# EAGLE design board (EAGLE 9.2.2)
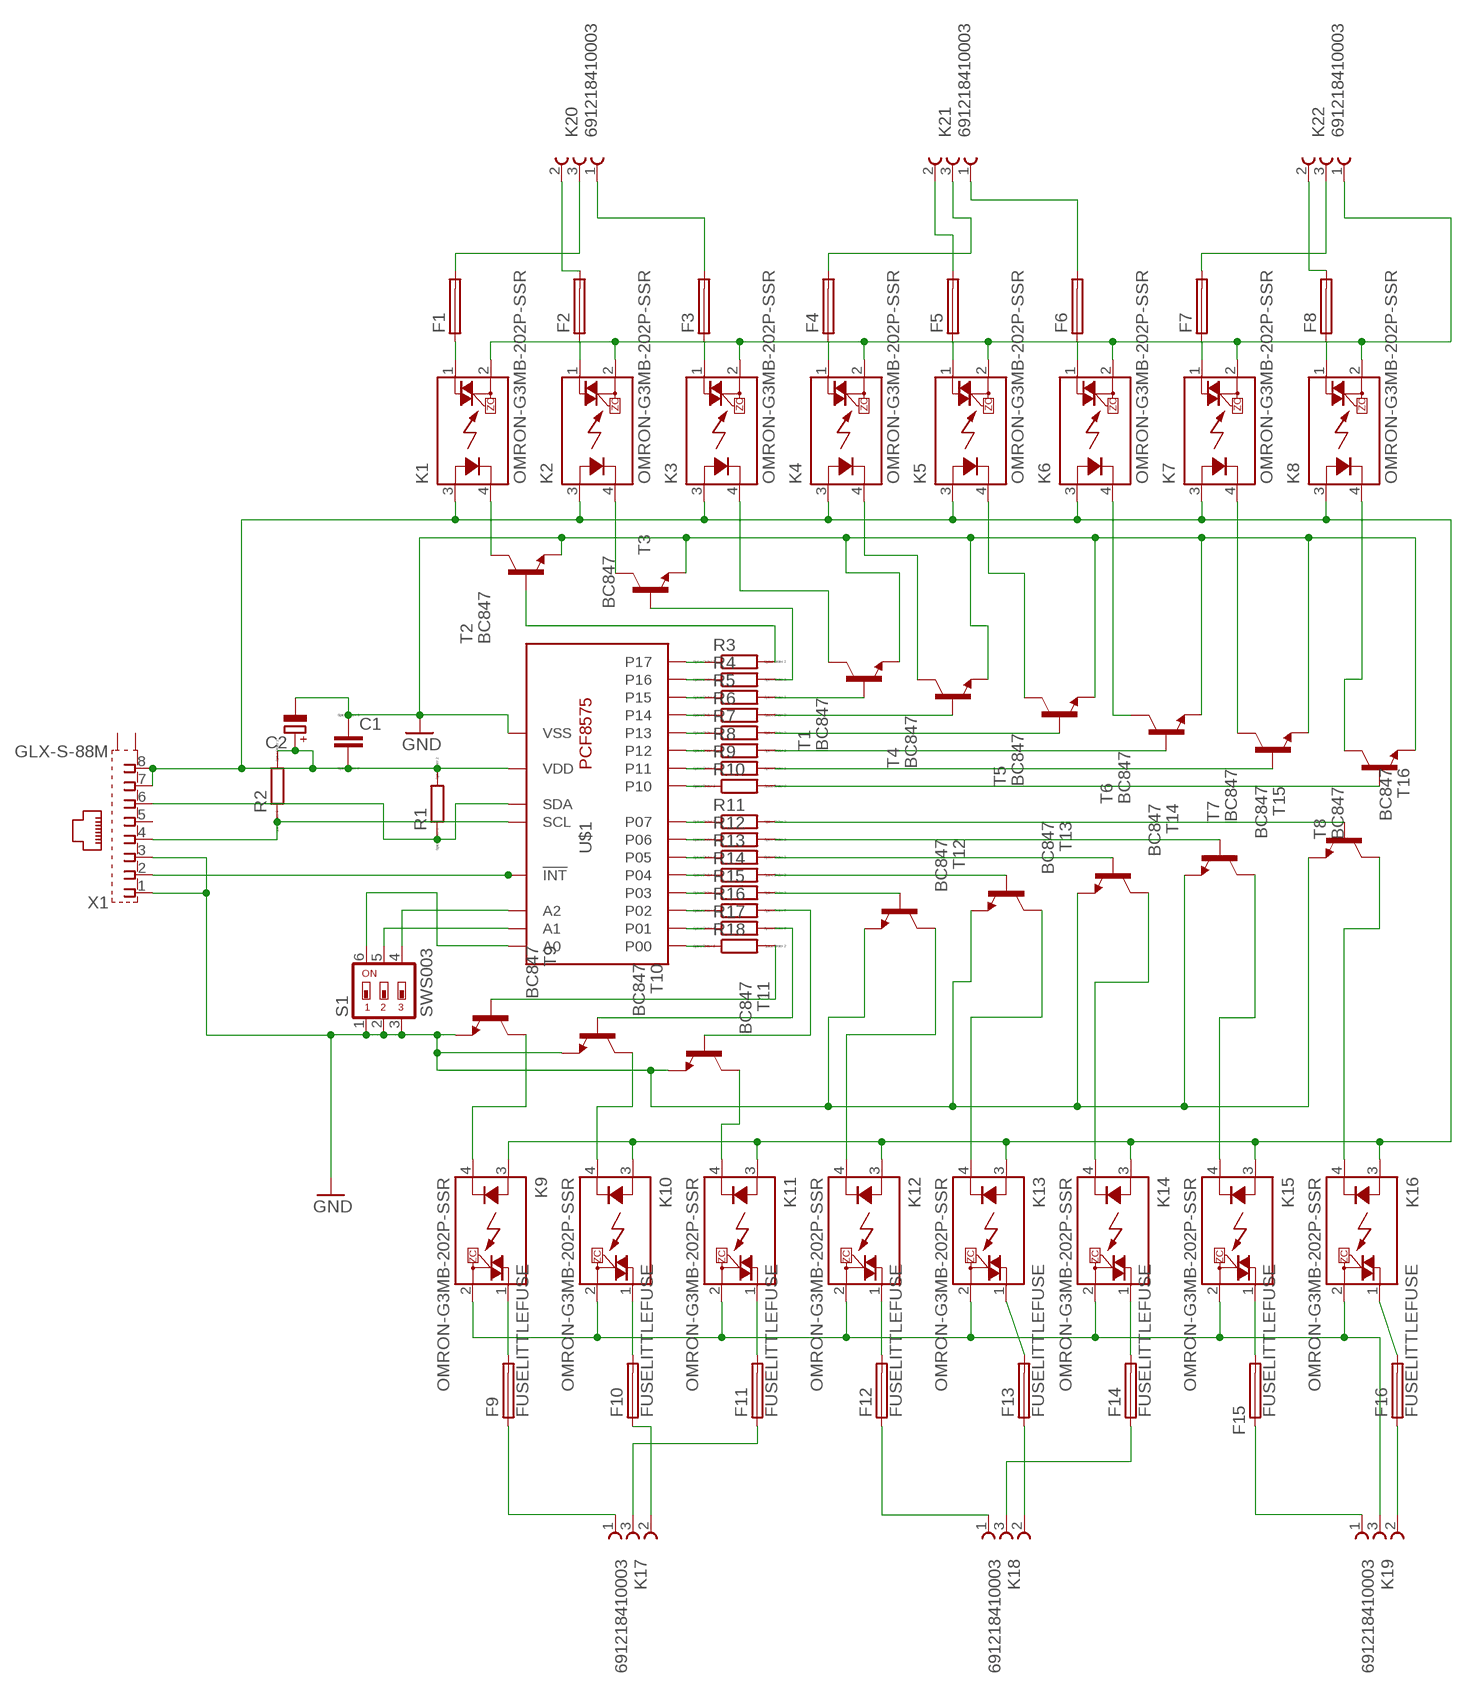
[diagram p0: schematic, sheet 1]

## Parts
C1  CC1206  [C1206]
C2  CPOL-EU150CLZ-0810  [150CLZ-0810]
F1  FUSELITTLEFUSE  [LITTLEFUSE]
F2  FUSELITTLEFUSE  [LITTLEFUSE]
F3  FUSELITTLEFUSE  [LITTLEFUSE]
F4  FUSELITTLEFUSE  [LITTLEFUSE]
F5  FUSELITTLEFUSE  [LITTLEFUSE]
F6  FUSELITTLEFUSE  [LITTLEFUSE]
F7  FUSELITTLEFUSE  [LITTLEFUSE]
F8  FUSELITTLEFUSE  [LITTLEFUSE]
F9  FUSELITTLEFUSE  [LITTLEFUSE]
F10  FUSELITTLEFUSE  [LITTLEFUSE]
F11  FUSELITTLEFUSE  [LITTLEFUSE]
F12  FUSELITTLEFUSE  [LITTLEFUSE]
F13  FUSELITTLEFUSE  [LITTLEFUSE]
F14  FUSELITTLEFUSE  [LITTLEFUSE]
F15  FUSELITTLEFUSE  [LITTLEFUSE]
F16  FUSELITTLEFUSE  [LITTLEFUSE]
K1  OMRON-G3MB-202P-SSR  [OMRON-G3MB-202P-SSR]
K2  OMRON-G3MB-202P-SSR  [OMRON-G3MB-202P-SSR]
K3  OMRON-G3MB-202P-SSR  [OMRON-G3MB-202P-SSR]
K4  OMRON-G3MB-202P-SSR  [OMRON-G3MB-202P-SSR]
K5  OMRON-G3MB-202P-SSR  [OMRON-G3MB-202P-SSR]
K6  OMRON-G3MB-202P-SSR  [OMRON-G3MB-202P-SSR]
K7  OMRON-G3MB-202P-SSR  [OMRON-G3MB-202P-SSR]
K8  OMRON-G3MB-202P-SSR  [OMRON-G3MB-202P-SSR]
K9  OMRON-G3MB-202P-SSR  [OMRON-G3MB-202P-SSR]
K10  OMRON-G3MB-202P-SSR  [OMRON-G3MB-202P-SSR]
K11  OMRON-G3MB-202P-SSR  [OMRON-G3MB-202P-SSR]
K12  OMRON-G3MB-202P-SSR  [OMRON-G3MB-202P-SSR]
K13  OMRON-G3MB-202P-SSR  [OMRON-G3MB-202P-SSR]
K14  OMRON-G3MB-202P-SSR  [OMRON-G3MB-202P-SSR]
K15  OMRON-G3MB-202P-SSR  [OMRON-G3MB-202P-SSR]
K16  OMRON-G3MB-202P-SSR  [OMRON-G3MB-202P-SSR]
K17  691218410003  [691218410003]
K18  691218410003  [691218410003]
K19  691218410003  [691218410003]
K20  691218410003  [691218410003]
K21  691218410003  [691218410003]
K22  691218410003  [691218410003]
R1  RR1206  [R1206]
R2  RR1206  [R1206]
R3  RR1206  [R1206]
R4  RR1206  [R1206]
R5  RR1206  [R1206]
R6  RR1206  [R1206]
R7  RR1206  [R1206]
R8  RR1206  [R1206]
R9  RR1206  [R1206]
R10  RR1206  [R1206]
R11  RR1206  [R1206]
R12  RR1206  [R1206]
R13  RR1206  [R1206]
R14  RR1206  [R1206]
R15  RR1206  [R1206]
R16  RR1206  [R1206]
R17  RR1206  [R1206]
R18  RR1206  [R1206]
S1  SWS003  [SMS-003]
T1  BC847  [SOT23]
T2  BC847  [SOT23]
T3  BC847  [SOT23]
T4  BC847  [SOT23]
T5  BC847  [SOT23]
T6  BC847  [SOT23]
T7  BC847  [SOT23]
T8  BC847  [SOT23]
T9  BC847  [SOT23]
T10  BC847  [SOT23]
T11  BC847  [SOT23]
T12  BC847  [SOT23]
T13  BC847  [SOT23]
T14  BC847  [SOT23]
T15  BC847  [SOT23]
T16  BC847  [SOT23]
U$1  PCF8575CSSOP24  [SOP65P775X200-24N]
X1  GLX-S-88M  [GLX-S-88M]

## Nets
GND: C1.1 C2.- S1.1 S1.2 S1.3 T1.2(E) T2.2(E) T3.2(E) T4.2(E) T5.2(E) T6.2(E) T7.2(E) T8.2(E) T9.2(E) T10.2(E) T11.2(E) T12.2(E) T13.2(E) T14.2(E) T15.2(E) T16.2(E) U$1.12(VSS) X1.1 X1.3
N$1: F16.2 K16.1(DS1)
N$2: U$1.1(!INT) X1.2
N$3: R3.1 U$1.20(P17)
N$4: R4.1 U$1.19(P16)
N$5: R18.2 T9.1(B)
N$6: R5.1 U$1.18(P15)
N$7: R6.1 U$1.17(P14)
N$8: R7.1 U$1.16(P13)
N$9: R8.1 U$1.15(P12)
N$10: R9.1 U$1.14(P11)
N$11: R10.1 U$1.13(P10)
N$12: R11.1 U$1.11(P07)
N$13: R12.1 U$1.10(P06)
N$14: R13.1 U$1.9(P05)
N$15: R14.1 U$1.8(P04)
N$16: R15.1 U$1.7(P03)
N$17: R16.1 U$1.6(P02)
N$18: R17.1 U$1.5(P01)
N$19: R2.1 U$1.22(SCL) X1.4
N$20: S1.4 U$1.3(A2)
N$21: R1.1 U$1.23(SDA) X1.6
N$22: K9.2(DS2) K10.2(DS2) K11.2(DS2) K12.2(DS2) K13.2(DS2) K14.2(DS2) K15.2(DS2) K16.2(DS2) K19.3
N$23: F13.2 K13.1(DS1)
N$24: F14.1 K18.3
N$25: F10.1 K17.2
N$26: F11.1 K17.3
N$27: S1.6 U$1.21(A0)
N$28: S1.5 U$1.2(A1)
N$29: C1.2 C2.+ K1.3(A) K2.3(A) K3.3(A) K4.3(A) K5.3(A) K6.3(A) K7.3(A) K8.3(A) K9.3(A) K10.3(A) K11.3(A) K12.3(A) K13.3(A) K14.3(A) K15.3(A) K16.3(A) R1.2 R2.2 U$1.24(VDD) X1.7 X1.8
N$30: F9.1 K17.1
N$31: F1.1 K1.1(DS1)
N$32: F2.1 K2.1(DS1)
N$33: F12.1 K18.1
N$34: F3.1 K3.1(DS1)
N$35: F4.1 K4.1(DS1)
N$36: F15.1 K19.1
N$37: F5.1 K5.1(DS1)
N$38: K1.2(DS2) K2.2(DS2) K3.2(DS2) K4.2(DS2) K5.2(DS2) K6.2(DS2) K7.2(DS2) K8.2(DS2) K22.1
N$39: F8.2 K22.2
N$40: F7.2 K22.3
N$41: F6.2 K21.1
N$42: F5.2 K21.2
N$43: F4.2 K21.3
N$44: F3.2 K20.1
N$45: F6.1 K6.1(DS1)
N$46: F1.2 K20.3
N$47: F7.1 K7.1(DS1)
N$48: F8.1 K8.1(DS1)
N$49: F9.2 K9.1(DS1)
N$50: F2.2 K20.2
N$51: F10.2 K10.1(DS1)
N$52: F11.2 K11.1(DS1)
N$53: F12.2 K12.1(DS1)
N$54: F14.2 K14.1(DS1)
N$55: F15.2 K15.1(DS1)
N$56: F16.1 K19.2
N$57: F13.1 K18.2
N$58: R18.1 U$1.4(P00)
N$59: R3.2 T2.1(B)
N$60: K1.4(K) T2.3(C)
N$61: R4.2 T3.1(B)
N$62: K2.4(K) T3.3(C)
N$63: R5.2 T1.1(B)
N$64: R6.2 T4.1(B)
N$65: R7.2 T5.1(B)
N$66: R8.2 T6.1(B)
N$67: R9.2 T7.1(B)
N$68: R10.2 T8.1(B)
N$69: K8.4(K) T8.3(C)
N$70: K7.4(K) T7.3(C)
N$71: K6.4(K) T6.3(C)
N$72: K5.4(K) T5.3(C)
N$73: R17.2 T10.1(B)
N$74: K4.4(K) T4.3(C)
N$76: K3.4(K) T1.3(C)
N$78: K9.4(K) T9.3(C)
N$79: K10.4(K) T10.3(C)
N$80: K11.4(K) T11.3(C)
N$81: R16.2 T11.1(B)
N$82: R11.2 T16.1(B)
N$83: R12.2 T15.1(B)
N$84: R13.2 T14.1(B)
N$85: R14.2 T13.1(B)
N$86: R15.2 T12.1(B)
N$87: K16.4(K) T16.3(C)
N$88: K15.4(K) T15.3(C)
N$89: K14.4(K) T14.3(C)
N$90: K13.4(K) T13.3(C)
N$92: K12.4(K) T12.3(C)
Unconnected: X1.5 X1.S1 X1.S2

## Library data of the parts
C1 = eagle-ltspice:C: CAPACITOR, European symbol; SPICEMODEL: NONE; SPICEPREFIX: C
C2 = rcl:CPOL-EU: POLARIZED CAPACITOR, European symbol; SPICEPREFIX: C
F1-F16 = fuse:FUSE: Fuse; OC_FARNELL: unknown; OC_NEWARK: unknown
K1-K16 = Omron G3MB 202p SSR:OMRON-G3MB-202P-SSR: IT(rms) 8A, Zero Cross type SIP 4pin Triac output SSR Source: http://sharp-world.com/products/device/lineup/data/pdf/datasheet/s102s02_e.pdf
K17-K22 = Wurth_Elektronik_Electromechanic_Terminal_Blocks_Connectors_rev15c:691218410003: WR-TBL Serie 2184 - 7.62mm Horizontal Entry Modular with Rising Cage Clamp - 5.3mm2 Wires, 3 Pins=>Code : Con_TBL_Screw_RisingClamp_7.62_691218410003 <http://katalog.we-online.de/media/images/eican/Con_TBL_Screw_RisingClamp_7.62_6912184100xx_pf2.jpg> Details see: http://katalog.we-online.de/en/em/691_218_410_0xx Created 2014-06-18, Karrer Zheng 2014 (C) Würth Elektronik
R1-R18 = eagle-ltspice:R: RESISTOR, European symbol; SPICEMODEL: NONE; SPICEPREFIX: R
S1 = smd-special:SWS003: SMD Dip Switch 3 pol.
T1-T16 = transistor:BC847: NPN TRANSISTOR
U$1 = pcf8575c:PCF8575C
X1 = con-kycon:GLX-S-88M: Mod. Jack, Right Angle, 8 posiotion, 8 contatcs RJ45 Source: GLX-S-88M.pdf; OC_FARNELL: unknown; OC_NEWARK: unknown

## Board
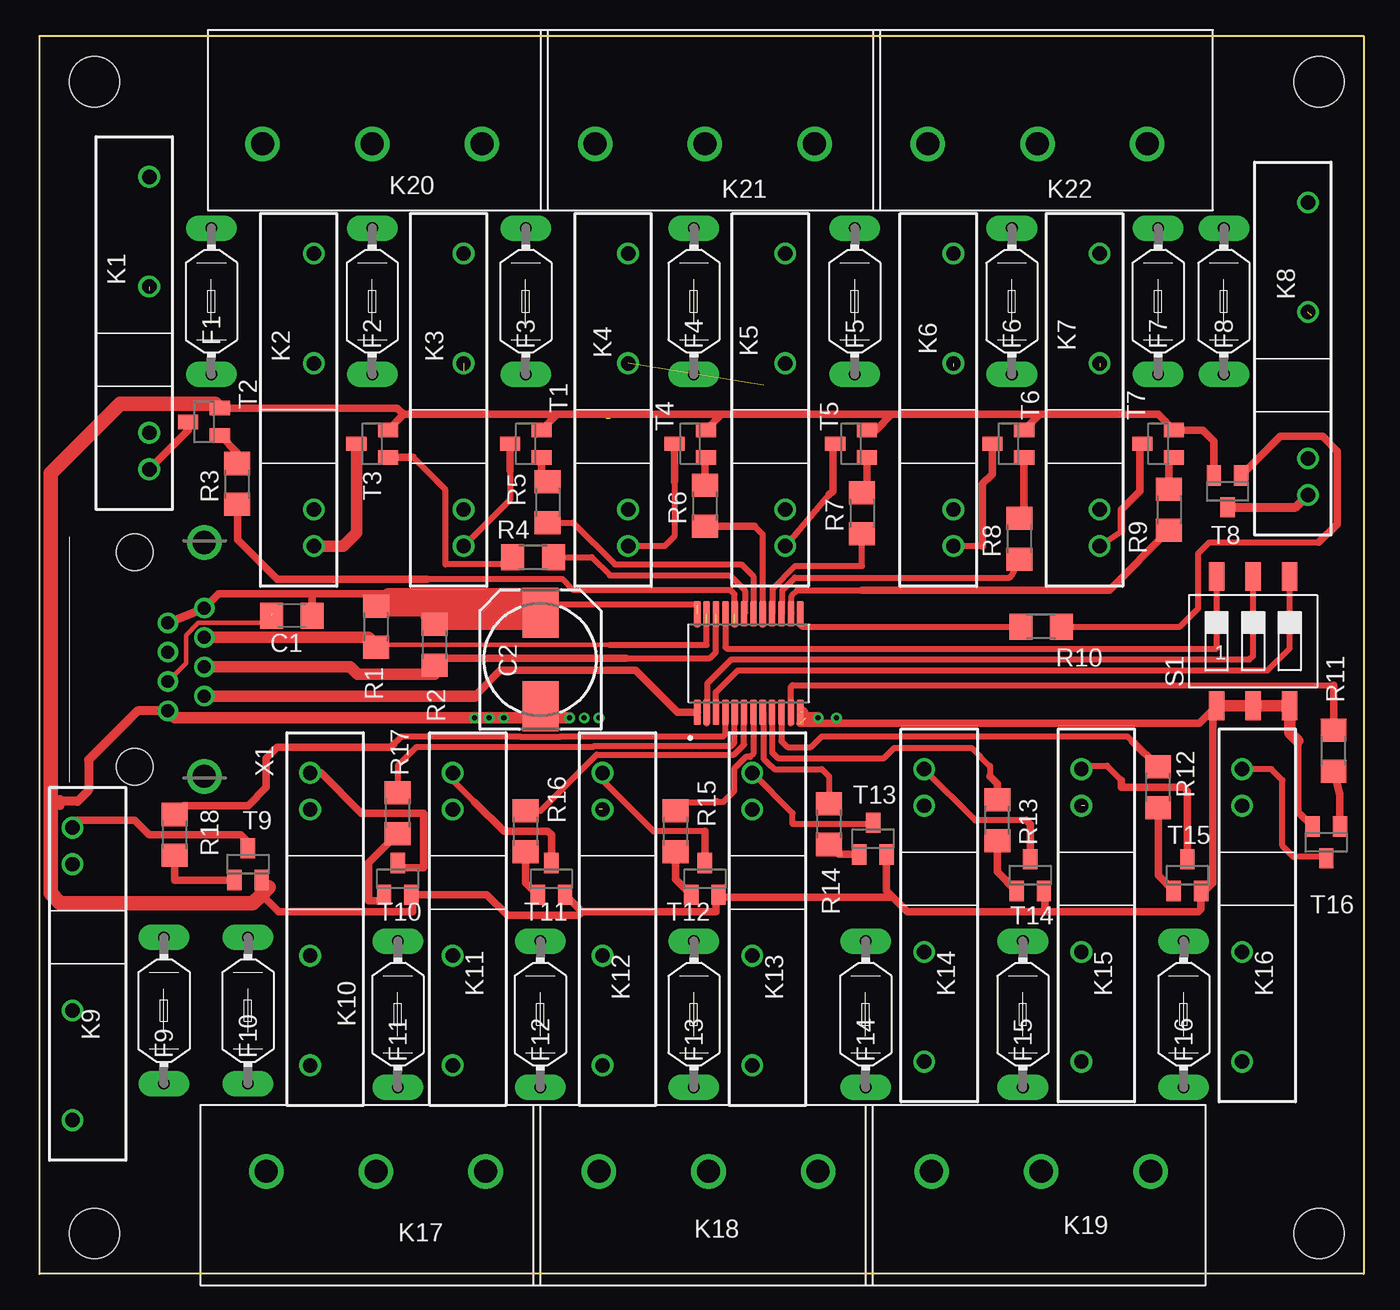
[diagram p1: board, top side]
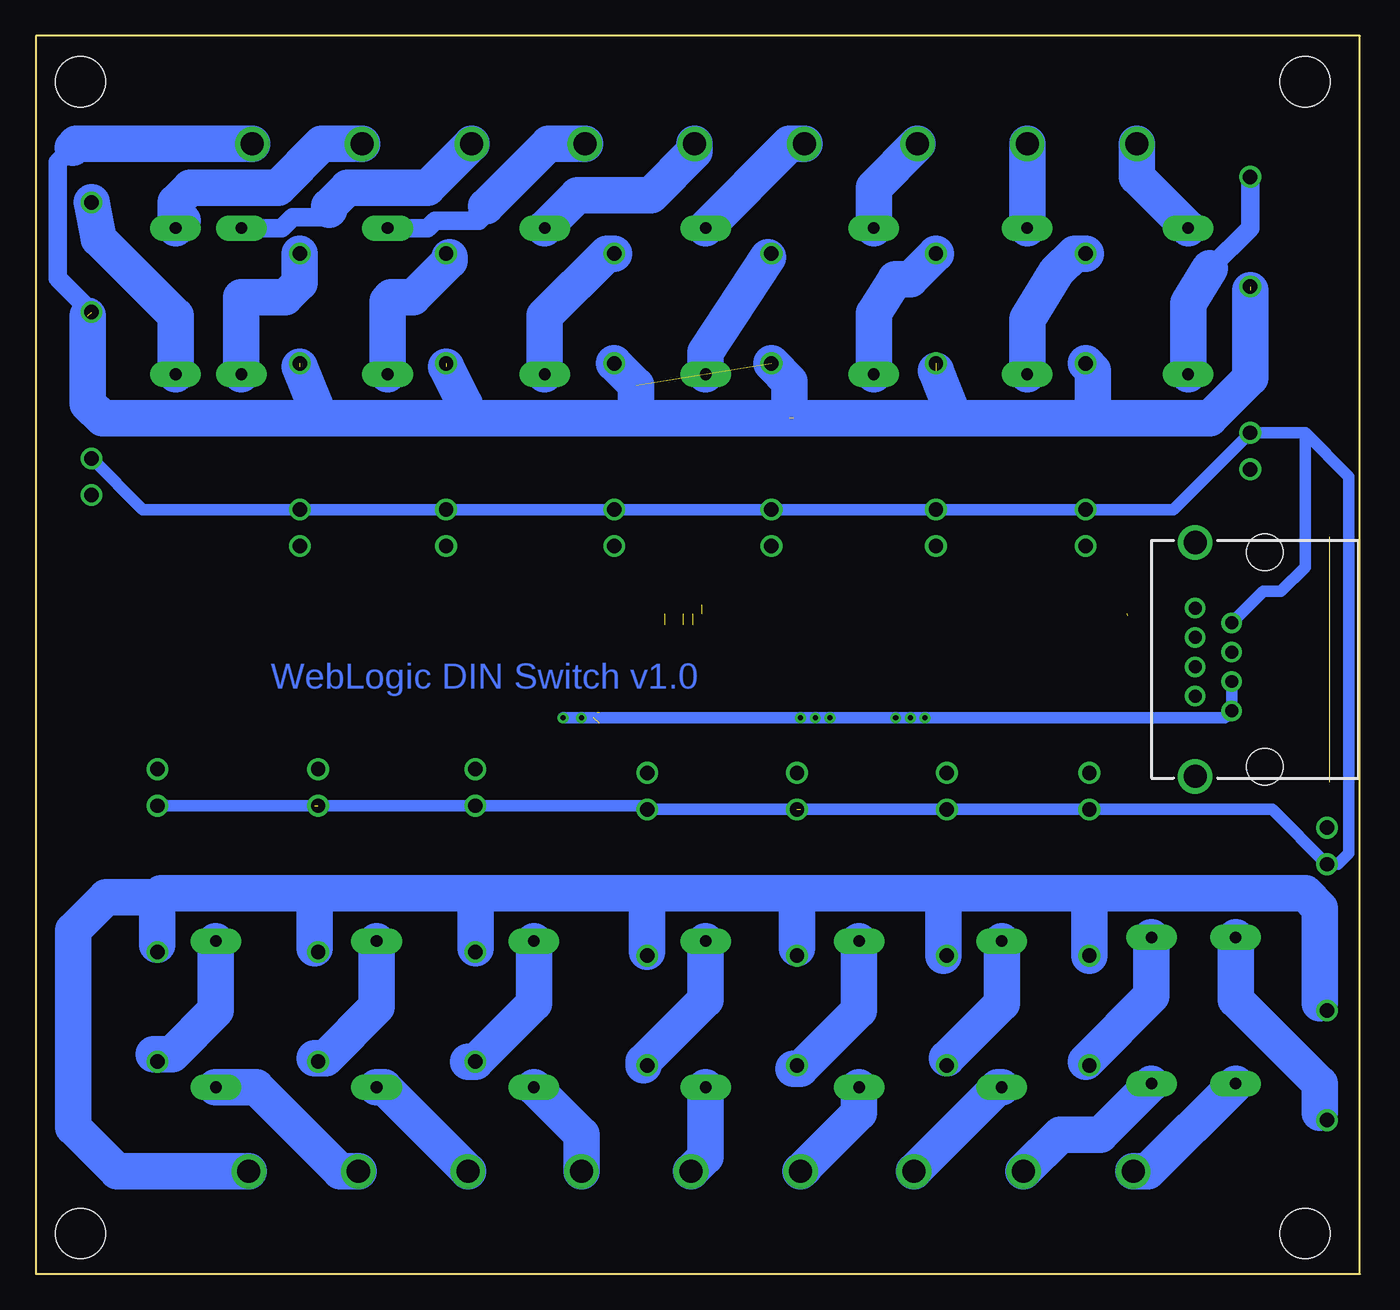
[diagram p2: board, bottom side, seen from below]

Size 92 x 86 mm. Coordinates in mm from the lower left corner, seen from the top.
Outline: 0,0 0,86 92,86 92,0 0,0
Copper layers (1*16): Top 0.035mm / dielectric 1.5mm / Bottom 0.035mm
Design rules "default": minimum track width 6mil, minimum drill 0.35mm, track to track 6mil, track to pad 6mil, pad to pad 6mil, via to via 6mil, smd to smd 6mil, copper to edge 40mil, drill to drill 6mil, minimum pad ring 10mil, minimum via ring 8mil, stop-mask expansion 4mil, vias tented up to drill 0mil, thermal gap 10mil
Holes 3.48 mm at 3.81,82.82 88.9,82.82 88.9,2.81 3.81,2.81

### Footprints (pad centres in the part's own frame; a part is rotated, then mirrored left to right if it is on the bottom)
C1206 = smd 1.6 x 1.8: 1 -1.4,0; 2 1.4,0
150CLZ-0810 = smd 3.5 x 2.5: + 3.25,0; - -3.25,0
LITTLEFUSE = drill 0.813 pad 1.778 long: 1 -5.08,0; 2 5.08,0
OMRON-G3MB-202P-SSR = drill 1: 1 -12.7,0; 2 -5.08,0; 3 5.08,0; 4 7.62,0
691218410003 = drill 1.6: 1 -7.62,0; 2 0,0; 3 7.62,0
R1206 = smd 1.6 x 1.803: 1 -1.422,0; 2 1.422,0
SMS-003 = smd 1.092 x 2.007: 1 -2.54,-4.496; 2 0,-4.496; 3 2.54,-4.496; 4 2.54,4.496; 5 0,4.496; 6 -2.54,4.496
SOT23 = smd 1 x 1.4: 1 -0.95,-1.1; 2 0.95,-1.1; 3 0,1.1
SOP65P775X200-24N = smd 1.78 x 0.48: 1 -3.42,3.575; 2 -3.42,2.925; 3 -3.42,2.275; 4 -3.42,1.625; 5 -3.42,0.975; 6 -3.42,0.325; 7 -3.42,-0.325; 8 -3.42,-0.975; 9 -3.42,-1.625; 10 -3.42,-2.275; 11 -3.42,-2.925; 12 -3.42,-3.575; 13 3.42,-3.575; 14 3.42,-2.925; 15 3.42,-2.275; 16 3.42,-1.625; 17 3.42,-0.975; 18 3.42,-0.325; 19 3.42,0.325; 20 3.42,0.975; 21 3.42,1.625; 22 3.42,2.275; 23 3.42,2.925; 24 3.42,3.575
GLX-S-88M = drill 0.9 pad 1.422: 1 -3.57,-2.3; 2 -2.55,-4.84; 3 -1.53,-2.3; 4 -0.51,-4.84; 5 0.51,-2.3; 6 1.53,-4.84; 7 2.55,-2.3; 8 3.57,-4.84 | drill 1.6 pad 2.184: S1 -8.125,-4.84; S2 8.125,-4.84 | hole 2.55: -7.44,0; 7.44,0

### Placement (x,y rotation side)
C1  17.53,45.74 0 top
C2  34.8,42.69 90 top
F1  11.94,67.58 90 top
F2  23.11,67.58 90 top
F3  33.78,67.58 90 top
F4  45.47,67.58 90 top
F5  56.64,67.58 90 top
F6  67.56,67.58 90 top
F7  77.72,67.58 90 top
F8  82.3,67.58 90 top
F9  8.64,18.3 90 top
F10  14.48,18.3 90 top
F11  24.89,18.05 90 top
F12  34.8,18.05 90 top
F13  45.47,18.05 90 top
F14  57.4,18.05 90 top
F15  68.33,18.05 90 top
F16  79.5,18.05 90 top
K1  7.62,63.52 270 top
K2  19.05,58.18 270 top
K3  29.46,58.18 270 top
K4  40.89,58.18 270 top
K5  51.82,58.18 270 top
K6  63.5,58.18 270 top
K7  73.66,58.18 270 top
K8  88.14,61.74 270 top
K9  2.29,23.38 90 top
K10  18.8,27.19 90 top
K11  28.7,27.19 90 top
K12  39.12,27.19 90 top
K13  49.53,27.19 90 top
K14  61.47,27.45 90 top
K15  72.39,27.45 90 top
K16  83.57,27.45 90 top
K17  23.37,7.13 0 top
K18  46.48,7.13 0 top
K19  69.6,7.13 0 top
K20  23.11,78.5 180 top
K21  46.23,78.5 180 top
K22  69.34,78.5 180 top
R1  23.37,44.97 90 top
R2  27.43,43.7 90 top
R3  13.72,54.88 90 top
R4  34.29,49.8 180 top
R5  35.31,53.61 90 top
R6  46.23,53.36 90 top
R7  57.15,52.85 90 top
R8  68.07,51.07 90 top
R9  78.49,53.1 90 top
R10  69.6,44.97 0 top
R11  89.92,36.34 270 top
R12  77.72,33.8 270 top
R13  66.55,31.51 270 top
R14  54.86,31.26 270 top
R15  44.2,30.75 270 top
R16  33.78,30.75 270 top
R17  24.89,32.02 270 top
R18  9.4,30.5 270 top
S1  84.33,43.96 0 top
T1  33.78,57.67 90 top
T2  11.43,59.2 90 top
T3  23.11,57.67 90 top
T4  45.21,57.67 90 top
T5  56.39,57.67 90 top
T6  67.31,57.67 90 top
T7  77.72,57.67 90 top
T8  82.55,54.37 180 top
T9  14.48,28.46 0 top
T10  24.89,27.45 0 top
T11  35.56,27.45 0 top
T12  46.23,27.45 0 top
T13  57.91,30.24 0 top
T14  68.83,27.7 0 top
T15  79.76,27.7 0 top
T16  89.41,29.99 180 top
U$1  49.28,42.43 90 top
X1  6.6,42.69 90 top

### Tracks (layer width: path | path; a pad name or v marks a point on that pad's centre or on a via)
GND  (via drill 0.35)  (3 unrouted)
  Top 0.305: S1.2 S1.3 | X1.3 10.17,42.43 10.17,44.38 11.02,45.23 15.52,45.23 16.15,45.86
  Top 0.508: 87.44,37.03 87.44,32.1 T16.2 | 81.46,39.13 S1.1 | S1.1 80.58,38.25 52.85,38.25 | T13.2 58.86,26.62 59.3,26.18 | 59.3,26.18 60.32,25.16 69.85,25.16 | 59.3,26.18 47.35,26.18 T12.2 46.99,26.16 46.99,25.16 37.7,25.16 | T11.2 37.7,25.16 | 37.7,25.16 37.44,24.91 32.51,24.91 31.07,26.35 T10.2 25.91,26.28 25.91,25.16 16.61,25.16 15.42,26.36 | T9.2 15.93,26.86 | T8.2 81.6,57.86 80.84,58.62 T7.2 77.74,59.71 69.49,59.71 | T6.2 69.49,59.71 | T5.2 58.1,58.62 59.18,59.71 | 59.18,59.71 69.49,59.71 | T4.2 47.39,59.71 | 47.39,59.71 59.18,59.71 | 35.96,59.71 47.39,59.71 | T1.2 35.96,59.71 | T3.2 25.3,59.71 | 25.3,59.71 35.96,59.71 | T2.2 24.85,60.15 25.3,59.71 | T14.2 69.85,26.54 69.85,25.16 | 69.85,25.16 80.52,25.16 80.71,25.35 T15.2 80.94,26.6 81.53,27.19 81.53,39.21 S1.1
  Top 0.61: X1.1 6.8,39.12 3.4,35.72 3.4,33.61 2.63,32.84 1.54,32.84 1.4,32.98 1.4,32.53
  Top 0.813: S1.1 S1.3 86.87,37.61 87.44,37.03 | X1.1 9.4,38.62 v30.23,38.62 v31.24,38.62 v32.26,38.62 34.8,38.62 | 34.8,38.62 C2.- | v54.1,38.62 53.24,38.62 53,38.87 53,39.01 | v36.83,38.62 34.8,38.62
  Top 1.016: T2.2 12.21,60.47 5.59,60.47 0.76,55.64 0.76,26.43 1.44,25.75 14.81,25.75 15.42,26.36 15.93,26.86
  Bottom 0.813: X1.3 X1.1 9.4,38.62 v30.23,38.62 v31.24,38.62 v32.26,38.62 v36.83,38.62 v37.85,38.62 v38.86,38.62 v54.1,38.62 v55.37,38.62
N$1
  Bottom 2.54: F16.2 79.5,18.3 82.55,15.26 83.82,15.26
N$2
  Top 0.508: 30.22,40.14 32,41.93 41.4,41.93 44.31,39.01 U$1.1
  Top 0.813: X1.2 30.22,40.14 30.23,40.15
N$3  (1 unrouted)
  Top 0.305: 14.12,53.06 13.77,53.41 R3.1
  Top 0.406: 48.3,45.09 48.3,47.22 48.01,47.51 37.08,47.51 36.32,48.28 26.92,48.28
  Top 0.508: 26.92,48.28 16.51,48.28 13.77,51.02 13.77,53.41
N$4
  Top 0.406: 36.14,50.23 R4.1 38.35,49.8 39.62,48.53 47.98,48.53 49.01,47.5 49.01,45.91 U$1.19
  Top 0.508: R4.1 36.22,49.8
N$5
  Top 0.508: T9.1 9.4,27.36 R18.2
N$6
  Top 0.406: R5.1 37.08,52.19 39.98,49.29 48.77,49.29 49.6,48.46 U$1.18
  Top 0.508: R5.1 35.41,52.09
N$7
  Top 0.406: 50.25,45.09 50.25,51.37 49.68,51.93
  Top 0.508: 49.68,51.93 R6.1
N$8
  Top 0.406: U$1.16 50.95,45.91 50.95,47.65 52.5,49.19 57.15,49.19 R7.1
N$9
  Top 0.406: U$1.15 51.6,45.91 51.6,47.5 52.48,48.38 67.41,48.38 67.56,48.53 R8.1
  Top 0.508: 67.72,49.29 R8.1
N$10
  Top 0.406: U$1.14 52.26,45.91 52.26,47.11 52.66,47.51 57.15,47.51
  Top 0.508: R9.1 74.32,47.51 57.15,47.51
N$11
  Top 0.406: 52.85,45.09 52.97,44.97 R10.1
N$12
  Top 0.406: 52.2,38.25 52.2,40.79 52.32,40.91 89.92,40.91
  Top 0.508: 89.92,40.91 R11.1
N$13
  Top 0.406: 51.55,38.25 51.55,37.02 51.98,36.59 53.59,36.59 54.36,37.35 75.59,37.35 75.92,37.02
  Top 0.508: 77.72,34.81 R12.1 75.92,37.02
N$14
  Top 0.406: 50.9,38.25 50.9,36.24 51.31,35.83 58.67,35.83 59.38,36.54 64.77,36.54 66.04,35.27 66.04,34.56
  Top 0.508: 66.28,33.2 R13.1 66.55,34.05 66.04,34.56
N$15
  Top 0.406: U$1.8 50.3,38.96 50.3,35.79 50.82,35.27 50.85,35.27 51.05,35.07 54.36,35.07 54.86,34.56 R14.1
N$16
  Top 0.406: R15.1 44.81,32.78 46.99,32.78 | 46.99,32.78 47.06,32.85 | U$1.7 49.6,36.16 49.37,35.92 49.07,35.92 48.26,35.11 48.26,33.54 47.5,32.78 46.99,32.78
  Top 0.508: R15.1 44.35,32.02
N$17
  Top 0.406: R16.1 34.8,32.17 38.71,36.08 48.26,36.08 48.95,36.77 U$1.6
N$18
  Top 0.406: U$1.5 48.26,38.97 48.26,36.87 48.03,36.64 38.48,36.64 38.43,36.59 26.16,36.59 24.89,35.32 R17.1
  Top 0.508: 24.89,33.8 R17.1
N$19  (1 unrouted)
  Top 0.406: 40.74,42.79 46.58,42.79 47,43.21 47,45.09
  Top 0.508: 40.74,42.79 27.94,42.79 R2.1
  Top 0.813: X1.4 21.59,42.18 22.1,41.67 27.43,41.67 R2.1
N$20
  Top 0.406: U$1.3 47,40.41 48.51,41.93 85.34,41.93 86.87,43.45 S1.4
N$21  (1 unrouted)
  Top 0.305: R1.1 23.52,43.7 39.62,43.7
  Top 0.406: 39.62,43.7 46.35,43.7 46.35,45.09
  Top 0.813: X1.6 22.85,44.22 23.37,43.7 R1.1
N$22
  Bottom 2.54: K19.3 86.36,7.13 89.41,10.18 89.41,23.89 87.12,26.18 83.57,26.18 | 2.79,18.81 2.79,25.42 3.81,26.43 18.8,26.43 | 83.57,26.18 83.31,26.18 83.31,26.43 72.9,26.43 | 72.9,26.43 61.47,26.43 | 61.47,26.43 49.53,26.43 | 49.53,26.43 39.12,26.43 | 39.12,26.43 29.21,26.43 | 29.21,26.43 18.8,26.43 | K10.2 18.8,26.43 | 29.21,26.43 28.96,26.18 28.96,22.11 | 39.12,22.62 39.12,26.43 | 49.53,22.37 49.53,26.43 | 61.47,22.62 61.47,26.43 | 72.64,22.62 72.64,26.18 72.9,26.43 | 83.57,22.88 83.57,26.18
N$23
  Bottom 2.54: F13.2 45.47,19.07 49.78,14.75 49.78,14.49
N$24
  Bottom 2.54: F14.1 54.1,9.67 K18.3
N$25
  Bottom 2.54: F10.1 18.03,9.67 20.83,9.67 K17.2
N$26
  Bottom 2.54: K17.3 25.15,12.97 F11.1
N$27
  Top 0.406: U$1.21 47.65,43.55 47.75,43.45 81.79,43.45 S1.6
N$28
  Top 0.406: 46.35,38.25 46.41,38.31 46.41,41.03 48.06,42.69 84.07,42.69 84.33,42.94 S1.5
N$29  (3 unrouted)
  Top 0.406: 22.76,46.4 R1.2 | 25.91,46.4 26.16,46.4 | 26.87,45.69 26.49,46.07 26.16,46.4 | 26.16,46.4 25.91,46.65 27.33,46.65 27.56,46.88 27.94,47.26 33.27,47.26 33.53,47.26 34.8,47.26 | 45.7,45.09 45.72,45.11 45.72,46.5 35.56,46.5 35.02,45.96 C2.+
  Top 0.508: X1.8 12.45,47.26 18.8,47.26 | 18.8,47.26 24.23,47.26 | 25.91,46.4 25.91,46.65 | 27.56,46.88 24,46.88 23.93,46.95 | C1.2 18.93,47.13 18.8,47.26
  Top 0.61: X1.7 X1.8
  Top 0.813: 33.95,46.41 33.53,46.84 33.53,47.26 | 33.27,47.26 24.23,47.26 23.93,46.95 R1.2 | R2.2 33.88,45.13 | 33.88,45.13 34.04,44.97 | 33.88,45.13 33.33,45.69 26.87,45.69 | 26.92,46.07 26.49,46.07 23.7,46.07 R1.2 | 26.92,46.07 33.6,46.07 33.95,46.41 | 33.95,46.41 34.39,46.85 C2.+ 34.46,46.65 27.33,46.65 | R1.2 25.91,46.4 26.59,46.4 26.92,46.07
  Top 1.016: 23.01,46.75 R1.2
  Bottom 0.813: 3.81,58.44 K1.3 12.95,53.1 K2.3 K3.3 K4.3 K5.3 K6.3 K7.3 84.58,53.1 K8.3 | 3.81,58.44 0.76,55.39 0.76,29.23 1.52,28.46 K9.3 6.1,32.27 K10.3 K11.3 K13.3 | 38.86,32.27 K13.3 | K13.3 49.78,32.53 K14.3 K16.3 72.64,32.53 | X1.7 6.71,47.43 5.49,47.43 3.81,49.11 3.81,58.44
N$30
  Bottom 2.54: F9.1 14.73,7.13 K17.1
N$31
  Bottom 1.27: 10.41,69.87 7.62,72.66 K1.1
  Bottom 2.54: 10.41,69.87 11.94,67.45 F1.1
N$32
  Bottom 2.54: F2.1 23.11,66.31 21.08,69.61 19.81,70.88 K2.1
N$33
  Bottom 2.54: 38.61,7.38 K18.1 34.8,11.19 F12.1
N$34
  Bottom 2.54: F3.1 33.78,66.73 32.26,69.1 31.24,69.1 K3.1
N$35
  Bottom 2.54: 41.15,70.63 45.47,64.04 F4.1
N$36
  Bottom 2.54: F15.1 67.82,12.97 K19.1
N$37
  Bottom 2.54: K5.1 52.32,70.88 56.64,66.56 F5.1
N$38  (7 unrouted)
  Bottom 1.27: K8.2 90.47,69.16 90.47,77.23 89.46,78.25
  Bottom 2.54: 88.39,66.56 88.39,60.47 87.38,59.45 72.64,59.45 | 18.54,59.45 10.41,59.45 7.62,62.25 7.62,68.34 | 72.64,59.45 62.48,59.45 | 62.48,59.45 39.62,59.45 39.62,61.99 K4.2 | 39.37,59.45 28.19,59.45 | 28.19,59.45 18.54,59.45 | 29.46,62.75 28.19,59.58 28.19,59.45 | 63.5,63.01 62.23,60.47 62.23,59.71 62.48,59.45 | 73.66,63.01 72.64,60.47 72.64,59.45 | K5.2 50.29,61.74 50.29,60.21 | K2.2 18.54,62.75 18.54,59.45 | K22.1 89.2,78.5 89.46,78.25
N$39
  Bottom 2.54: 81.79,73.17 F8.2 82.3,74.44 81.28,75.45 75.18,75.45 72.14,78.5 K22.2
N$40
  Bottom 1.27: F7.2 74.93,72.66 74.17,73.42 71.63,73.42 71.63,74.18
  Bottom 2.54: K22.3 64.77,75.45 70.36,75.45 71.63,74.18 71.63,73.93
N$41
  Bottom 1.27: F6.2 64.77,72.66 64.26,73.17 61.21,73.17 60.71,73.68 60.71,74.18
  Bottom 2.54: K21.1 56.39,78.5 60.71,74.18
N$42
  Bottom 2.54: F5.2 54.36,74.95 49.28,74.95 46.23,77.99 K21.2
N$43
  Bottom 2.54: F4.2 39.62,78.5 K21.3
N$44
  Bottom 2.54: F3.2 33.78,75.45 K20.1
N$45
  Bottom 2.54: 63.25,70.63 63.25,70.37 65.79,67.83 67.31,67.83 67.56,67.58 F6.1
N$46
  Bottom 2.54: F1.2 15.49,76.22 K20.3
N$47
  Bottom 2.54: K7.1 73.66,68.85 74.68,67.83 77.72,67.83 F7.1
N$48
  Bottom 2.54: F8.1 82.3,66.56 87.63,71.9 K8.1
N$49
  Bottom 2.54: F9.2 8.64,19.07 2.79,13.22 2.79,11.19
N$50
  Bottom 2.54: F2.2 K20.2
N$51
  Bottom 2.54: F10.2 14.48,19.32 19.05,14.75
N$52
  Bottom 2.54: F11.2 24.89,18.81 28.7,15
N$53
  Bottom 2.54: F12.2 34.8,18.3 38.86,14.24 39.37,14.24
N$54
  Bottom 2.54: F14.2 57.4,18.81 K14.1 61.98,14.75
N$55
  Bottom 2.54: F15.2 68.33,18.56 71.88,15 72.64,15
N$56
  Bottom 2.54: F16.1 76.71,12.97 70.87,7.13 K19.2
N$57
  Bottom 2.54: F13.1 45.47,8.14 K18.2
N$58
  Top 0.406: 24.64,36.85 25.15,37.35 33.38,37.35 33.4,37.33 36.2,37.33 36.22,37.35 47.5,37.35 47.65,37.51 U$1.4
  Top 0.508: 24.64,36.85 24.38,36.59 16.51,36.59 15.75,35.83 15.75,33.8 14.48,32.53 10.01,32.53 R18.1
N$59
  Top 0.508: T2.1 13.72,57.06 R3.2
N$60
  Top 0.508: T2.3 10.33,58.61 K1.4
N$61
  Top 0.406: R4.2 32.36,49.29 28.19,49.29 28.19,54.47 25.94,56.72
  Top 0.508: 25.94,56.72 T3.1
N$62
  Top 0.508: T3.3 22.01,55.81
  Top 0.813: T3.3 22.01,51.49 21.08,50.56 K2.4
N$63
  Top 0.508: T1.1 34.88,55.46 R5.2
N$64
  Top 0.508: T4.1 46.23,56.64 R6.2
N$65
  Top 0.508: T5.1 57.49,54.61 R7.2
N$66
  Top 0.508: T6.1 68.41,52.83 R8.2
N$67
  Top 0.508: T7.1 78.49,56.39 R9.2
N$68
  Top 0.406: R10.2 79.25,44.97 80.52,46.24 80.52,50.05 81.28,50.82 88.9,50.82
  Top 0.508: T8.1 86.21,58.18 89.15,58.18 90.17,57.17 90.17,52.09 88.9,50.82
N$69
  Top 0.61: T8.3 87.29,53.27 K8.4
N$70
  Top 0.406: 75.18,51.58 K7.4
  Top 0.508: T7.3 76.45,57.5 76.45,54.37 75.18,53.1 75.18,51.58
N$71
  Top 0.406: 65.53,50.56 K6.4
  Top 0.508: T6.3 66.21,55.56 65.53,54.88 65.53,50.56
N$72
  Top 0.406: 54.86,54.12 K5.4
  Top 0.508: T5.3 55.12,57.5 55.12,54.37 54.86,54.12
N$73
  Top 0.508: T10.1 23.52,25.92 22.86,25.92 22.86,28.57 R17.2
N$74
  Top 0.406: 44.11,55.05 44.11,51.24 43.43,50.56 K4.4
  Top 0.508: T4.3 44.11,55.05
N$76
  Top 0.406: 32.68,55.81 32.68,53.78 K3.4
  Top 0.508: T1.3 32.68,55.81
N$78
  Top 0.508: 2.29,31.51 6.6,31.51 7.62,30.5 13.97,30.5 14.48,29.99 T9.3
N$79
  Top 0.508: T10.3 25.23,28.21 26.67,28.21 26.67,32.02 22.35,32.02 19.56,34.81 K10.4
N$80
  Top 0.406: 30.23,32.78 28.7,34.31 K11.4
  Top 0.508: T11.3 35.56,30.5 35.31,30.75 32.26,30.75 30.23,32.78
N$81
  Top 0.508: R16.2 33.78,27.18 T11.1
N$82
  Top 0.508: T16.1 90.36,33.32 R11.2
N$83
  Top 0.508: T15.1 77.72,27.68 R12.2
N$84
  Top 0.508: T14.1 66.55,27.94 R13.2
N$85
  Top 0.508: R14.2 55.56,29.14 T13.1
N$86
  Top 0.508: T12.1 44.2,27.43 R15.2
N$87
  Top 0.406: T16.3 89.32,28.97 87.12,28.97 86.36,29.73 86.36,34.31 85.6,35.07 K16.4
N$88
  Top 0.406: 72.39,35.32 74.17,35.32 75.18,34.31
  Top 0.508: T15.3 79.76,33.54 79.5,33.8 75.18,33.8 75.18,34.31
N$89
  Top 0.406: 68.58,31.51 65.02,31.51 K14.4
  Top 0.508: T14.3 68.83,31.26 68.58,31.51
N$90
  Top 0.406: T13.3 57.83,31.26 52.32,31.26 52.32,32.02 K13.4
N$92
  Top 0.406: 46.23,30.75 42.67,30.75 39.12,34.31 K12.4
  Top 0.508: T12.3 46.23,30.75

### Text on the board
Bottom: WebLogic DIN Switch v1.0